# EAGLE schematic motor (EAGLE 7.6.0)
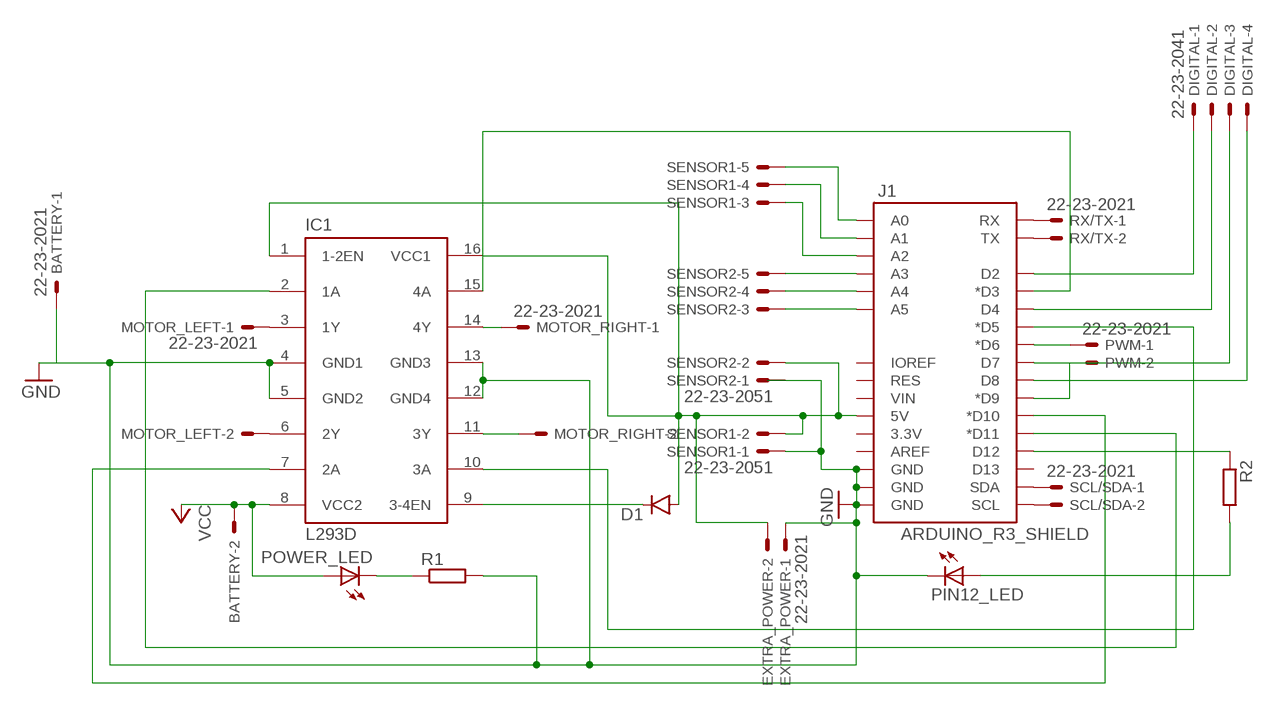
[diagram p0: schematic, sheet 1]

## Parts
BATTERY  22-23-2021  [22-23-2021]
D1  DIODEPTH  [DIODE-1N4001]
DIGITAL  22-23-2041  [22-23-2041]
EXTRA_POWER  22-23-2021  [22-23-2021]
IC1  L293D  [DIL16]
J1  ARDUINO_R3_SHIELD  [UNO_R3_SHIELD]
MOTOR_LEFT  22-23-2021  [22-23-2021]
MOTOR_RIGHT  22-23-2021  [22-23-2021]
PIN12_LED  LEDSMT1206  [1206]
POWER_LED  LEDSMT1206  [1206]
PWM  22-23-2021  [22-23-2021]
R1  R-EU_R1206  [R1206]
R2  R-EU_R1206  [R1206]
RX/TX  22-23-2021  [22-23-2021]
SCL/SDA  22-23-2021  [22-23-2021]
SENSOR1  22-23-2051  [22-23-2051]
SENSOR2  22-23-2051  [22-23-2051]

## Nets
GND: BATTERY.1 EXTRA_POWER.1 IC1.4(GND1) IC1.5(GND2) IC1.12(GND4) IC1.13(GND3) J1.GND@0(GND) J1.GND@1(GND) J1.GND@2(GND) PIN12_LED.C R1.2 SENSOR1.1
N$1: D1.A EXTRA_POWER.2 IC1.1(1-2EN) IC1.16(VCC1) J1.5V SENSOR1.2 SENSOR2.2
N$2: D1.C IC1.9(3-4EN)
N$3: IC1.15(4A) J1.D3(*D3)
N$4: J1.A0 SENSOR1.5
N$5: IC1.10(3A) J1.D5(*D5)
N$6: IC1.7(2A) J1.D10(*D10)
N$7: IC1.2(1A) J1.D11(*D11)
N$8: J1.A1 SENSOR1.4
N$9: J1.A2 SENSOR1.3
N$10: IC1.6(2Y) MOTOR_LEFT.2
N$11: IC1.14(4Y) MOTOR_RIGHT.1
N$12: IC1.11(3Y) MOTOR_RIGHT.2
N$13: IC1.3(1Y) MOTOR_LEFT.1
N$14: J1.A3 SENSOR2.5
N$15: J1.A4 SENSOR2.4
N$16: J1.A5 SENSOR2.3
N$17: POWER_LED.C R1.1
N$18: J1.D6(*D6) PWM.1
N$19: J1.D9(*D9) PWM.2
N$20: J1.SDA SCL/SDA.1
N$21: J1.SCL SCL/SDA.2
N$22: J1.RX RX/TX.1
N$23: J1.TX RX/TX.2
N$24: DIGITAL.1 J1.D2
N$25: DIGITAL.2 J1.D4
N$26: DIGITAL.3 J1.D7
N$27: DIGITAL.4 J1.D8
N$28: J1.D12 R2.1
N$29: PIN12_LED.A R2.2
VCC: BATTERY.2 IC1.8(VCC2) POWER_LED.A
Unconnected: J1.3.3V J1.AREF J1.D13 J1.IOREF J1.RES J1.VIN SENSOR2.1

## Library data of the parts
BATTERY EXTRA_POWER MOTOR_LEFT MOTOR_RIGHT PWM RX/TX SCL/SDA = con-molex:22-23-2021: .100" (2.54mm) Center Header - 2 Pin; MF: MOLEX; MPN: 22-23-2021; OC_FARNELL: 1462926; OC_NEWARK: 25C3832
D1 = SparkFun-DiscreteSemi:DIODE: Diode These are standard reverse protection diodes and small signal diodes. SMA package can handle up to about 1A. SOD-323 can handle about 200mA. What the SOD-323 package when ordering, there are some mfgs out there that are 5-pin packages.
DIGITAL = con-molex:22-23-2041: .100" (2.54mm) Center Header - 4 Pin; MF: MOLEX; MPN: 22-23-2041; OC_FARNELL: 1462920; OC_NEWARK: 38C0355
IC1 = st-microelectronics:L293D: PUSH-PULL 4 CHANNEL DRIVER; MPN: L293D; OC_FARNELL: 9589619; OC_NEWARK: 56P8249
J1 = SparkFun-Boards:ARDUINO_R3_SHIELD: Shield form compatible with the Arduino Uno R3.
PIN12_LED POWER_LED = led:LED: LED OSRAM: - CHIPLED LG R971, LG N971, LY N971, LG Q971, LY Q971, LO R971, LY R971 LH N974, LH R974 LS Q976, LO Q976, LY Q976 LO Q996 - Hyper CHIPLED LW Q18S LB Q993, LB Q99A, LB R99A - SideLED LS A670, LO A670, LY A670, LG A670, LP A670 LB A673, LV A673, LT A673, LW A673 LH A674 LY A675 LS A676, LA A676, LO A676, LY A676, LW A676 LS A679, LY A679, LG A679 - Hyper Micro SIDELED® LS Y876, LA Y876, LO Y876, LY Y876 LT Y87S - SmartLED LW L88C, LW L88S LB L89C, LB L89S, LG L890 LS L89K, LO L89K, LY L89K LS L896, LA L896, LO L896, LY L896 - TOPLED LS T670, LO T670, LY T670, LG T670, LP T670 LSG T670, LSP T670, LSY T670, LOP T670, LYG T670 LG T671, LOG T671, LSG T671 LB T673, LV T673, LT T673, LW T673 LH T674 LS T676, LA T676, LO T676, LY T676, LB T676, LH T676, LSB T676, LW T676 LB T67C, LV T67C, LT T67C, LS T67K, LO T67K, LY T67K, LW E67C LS E67B, LA E67B, LO E67B, LY E67B, LB E67C, LV E67C, LT E67C LW T67C LS T679, LY T679, LG T679 LS T770, LO T770, LY T770, LG T770, LP T770 LB T773, LV T773, LT T773, LW T773 LH T774 LS E675, LA E675, LY E675, LS T675 LS T776, LA T776, LO T776, LY T776, LB T776 LHGB T686 LT T68C, LB T68C - Hyper Mini TOPLED® LB M676 - Mini TOPLED Santana® LG M470 LS M47K, LO M47K, LY M47K Source: http://www.osram.convergy.de LUXEON: - LUMILED® LXK2-PW12-R00, LXK2-PW12-S00, LXK2-PW14-U00, LXK2-PW14-V00 LXK2-PM12-R00, LXK2-PM12-S00, LXK2-PM14-U00 LXK2-PE12-Q00, LXK2-PE12-R00, LXK2-PE12-S00, LXK2-PE14-T00, LXK2-PE14-U00 LXK2-PB12-K00, LXK2-PB12-L00, LXK2-PB12-M00, LXK2-PB14-N00, LXK2-PB14-P00, LXK2-PB14-Q00 LXK2-PR12-L00, LXK2-PR12-M00, LXK2-PR14-Q00, LXK2-PR14-R00 LXK2-PD12-Q00, LXK2-PD12-R00, LXK2-PD12-S00 LXK2-PH12-R00, LXK2-PH12-S00 LXK2-PL12-P00, LXK2-PL12-Q00, LXK2-PL12-R00 Source: www.luxeon.com KINGBRIGHT: KA-3528ASYC Source: www.kingbright.com
R1 R2 = resistor:R-EU_: RESISTOR, European symbol
SENSOR1 SENSOR2 = con-molex:22-23-2051: .100" (2.54mm) Center Header - 5 Pin; MF: MOLEX; MPN: 22-23-2051; OC_FARNELL: 1462952; OC_NEWARK: 38C9178